# Altium schematic sheet Temperature_Sense.SchDoc
size A4; Organization: TESLA Motors, INC; Address1: 3500 Deer Creek Road; Address2: Palo Alto, CA; Address4: U.S.A.; SheetNumber: 7; SheetTotal: 8
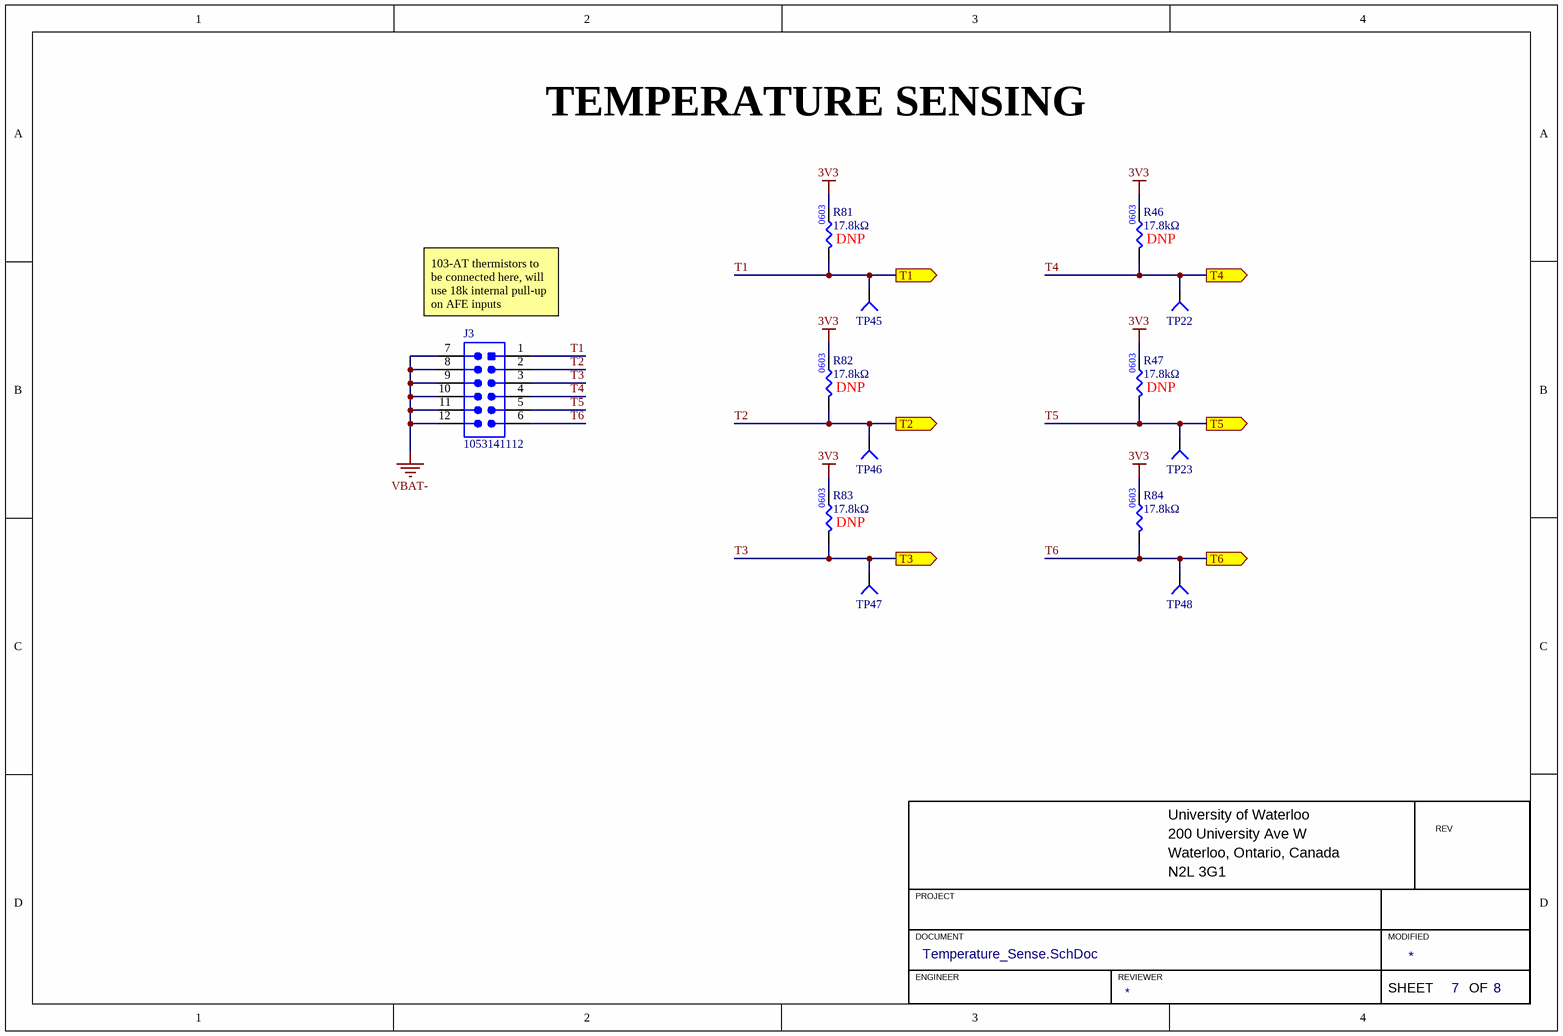
[diagram p0: Temperature_Sense.SchDoc]

## Parts
J3  1053141112  [MOLEX-NANOFIT 6x2 THRA]
R46  value 17.8kΩ  [RES0603]  (hidden comment: RES_17.8kΩ_0603_1%)
R47  value 17.8kΩ  [RES0603]  (hidden comment: RES_17.8kΩ_0603_1%)
R81  value 17.8kΩ  [RES0603]  (hidden comment: RES_17.8kΩ_0603_1%)
R82  value 17.8kΩ  [RES0603]  (hidden comment: RES_17.8kΩ_0603_1%)
R83  value 17.8kΩ  [RES0603]  (hidden comment: RES_17.8kΩ_0603_1%)
R84  value 17.8kΩ  [RES0603]  (hidden comment: RES_17.8kΩ_0603_1%)
TP22  TESTPOINT_1MM_CIRCLE  [TESTPOINT_CIRCLE_1MM]  (value not drawn)  (no BOM)
TP23  TESTPOINT_1MM_CIRCLE  [TESTPOINT_CIRCLE_1MM]  (value not drawn)  (no BOM)
TP45  TESTPOINT_1MM_CIRCLE  [TESTPOINT_CIRCLE_1MM]  (value not drawn)  (no BOM)
TP46  TESTPOINT_1MM_CIRCLE  [TESTPOINT_CIRCLE_1MM]  (value not drawn)  (no BOM)
TP47  TESTPOINT_1MM_CIRCLE  [TESTPOINT_CIRCLE_1MM]  (value not drawn)  (no BOM)
TP48  TESTPOINT_1MM_CIRCLE  [TESTPOINT_CIRCLE_1MM]  (value not drawn)  (no BOM)

## Ports
T1 (out), T2 (out), T3 (out), T4 (out), T5 (out), T6 (out)

## Nets
3V3: R46.2 R47.2 R81.2 R82.2 R83.2 R84.2
VBAT-: J3.7 J3.8 J3.9 J3.10 J3.11 J3.12
T1: J3.1 R81.1 TP45.1(=value) ; port T1
T2: J3.2 R82.1 TP46.1(=value) ; port T2
T3: J3.3 R83.1 TP47.1(=value) ; port T3
T4: J3.4 R46.1 TP22.1(=value) ; port T4
T5: J3.5 R47.1 TP23.1(=value) ; port T5
T6: J3.6 R84.1 TP48.1(=value) ; port T6

## Notes on the sheet
- TEMPERATURE SENSING
- (near R81) DNP
- (near R46) DNP
- (near J3) 103-AT thermistors to be connected here, will use 18k internal pull-up on AFE inputs
- (near R82) DNP
- (near R47) DNP
- (near R83) DNP
- University of Waterloo
- 200 University Ave W
- REV
- PROJECT
- Waterloo, Ontario, Canada
- N2L 3G1
- DOCUMENT
- ENGINEER
- REVIEWER
- MODIFIED
- SHEET
- OF
- (in symbol RES_17.8kΩ_0603_1%) 0603

## Library data of the parts
J3 = CON_MOLEX-NANOFIT_6x2_THRA: CONN HEADER R/A 12POS 2.5MM; Manufacturer 1: Molex; Voltage Rating: 400V; Current Rating: 15A; Pitch: 3.5mm; Supplier 1: Digi-Key; Supplier Part Number 1: WM16911-ND; Manufacturer Part Number 1: 1053141112
R46 R47 R81-R84 = RES_17.8kΩ_0603_1%: RES 17.8K OHM 1% 1/10W 0603; Manufacturer 1: YAGEO; Manufacturer Part Number 1: RC0603FR-0717K8L; Supplier Part Number 1: 311-17.8KHRCT-ND; Supplier 1: Digi-Key
TP22 TP23 TP45-TP48 = TESTPOINT_1MM_CIRCLE: TESTPOINT 1MM CIRCLE